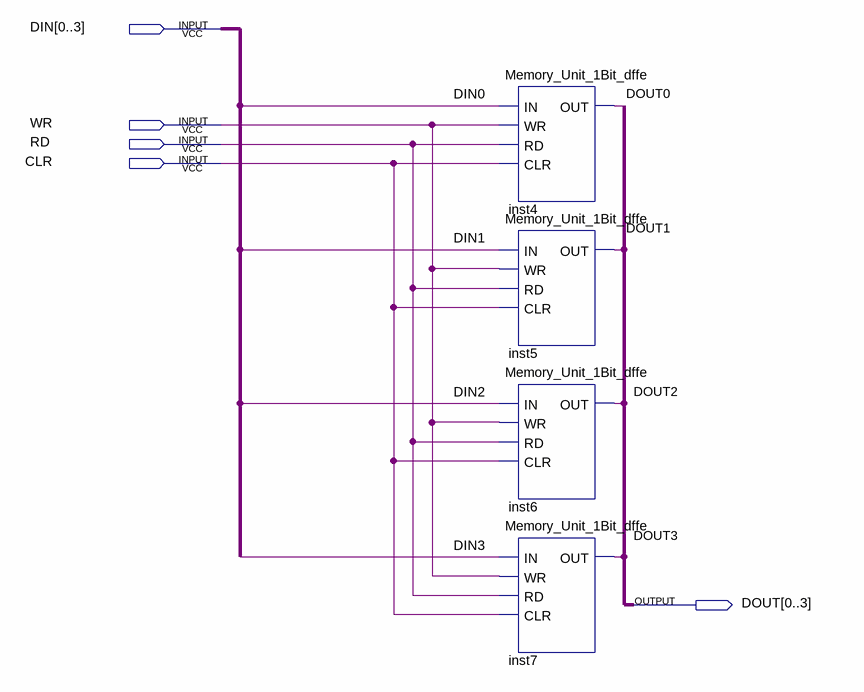
[diagram p0: schematic sheet]
// Quartus schematic Table_Unit_4Bit.bdf as structural Verilog: 4 symbols, 5 pins
module Table_Unit_4Bit (
  input  [0:3] DIN,
  input  WR,
  input  RD,
  input  CLR,
  output [0:3] DOUT
);

  Memory_Unit_1Bit_dffe inst4 (.IN(DIN[0]), .WR(WR), .RD(RD), .CLR(CLR), .OUT(DOUT[0]));
  Memory_Unit_1Bit_dffe inst5 (.IN(DIN[1]), .WR(WR), .RD(RD), .CLR(CLR), .OUT(DOUT[1]));
  Memory_Unit_1Bit_dffe inst6 (.IN(DIN[2]), .WR(WR), .RD(RD), .CLR(CLR), .OUT(DOUT[2]));
  Memory_Unit_1Bit_dffe inst7 (.IN(DIN[3]), .WR(WR), .RD(RD), .CLR(CLR), .OUT(DOUT[3]));
endmodule
